# Altium project CartOgraphie.PrjPcb
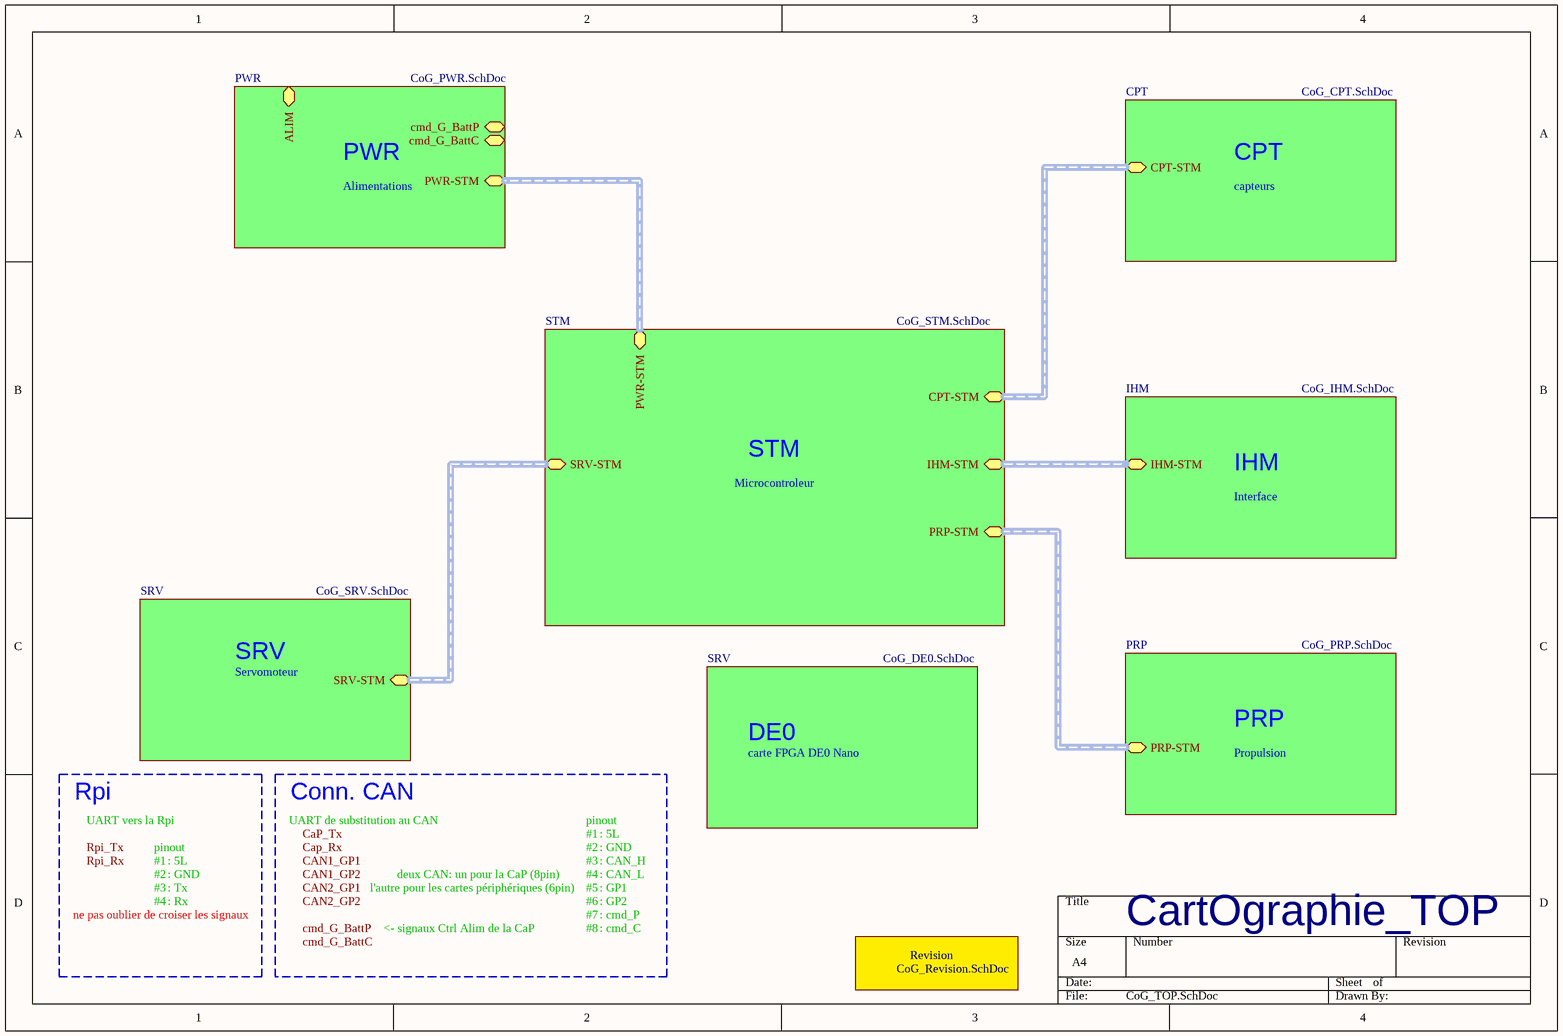
[diagram p0: CoG_TOP.SchDoc]
7 sheets, 65 parts. Net scope: hierarchical (ports join the sheet entries above them; power ports are global).
Board file: CartOgraphie.PcbDoc
Sheets:
  CoG_TOP.SchDoc
    Revision = CoG_Revision.SchDoc
    CPT = CoG_CPT.SchDoc
    PWR = CoG_PWR.SchDoc
    SRV = CoG_SRV.SchDoc
    STM = CoG_STM.SchDoc
    SRV = CoG_DE0.SchDoc

## Sheet CoG_TOP.SchDoc
size A4; Author: Audran; CompanyName: Goldorak; Address1: Electrolab; Address2: 52 rue Paul Lescop; Address3: 92000 Nanterre; ProjectName: Cartes_2017

### Sub-sheets
CPT = CoG_CPT.SchDoc: CPT-STM (harness CPT-STM)
IHM = CoG_IHM.SchDoc (file not in this document): IHM-STM (harness IHM-STM)
PRP = CoG_PRP.SchDoc (file not in this document): PRP-STM (harness PRP-STM)
PWR = CoG_PWR.SchDoc: PWR-STM (harness PWR-STM), cmd_G_BattP, cmd_G_BattC, ALIM (harness ALIM)
Revision = CoG_Revision.SchDoc: no entries
SRV = CoG_SRV.SchDoc: SRV-STM (harness SRV-STM)
SRV = CoG_DE0.SchDoc: no entries
STM = CoG_STM.SchDoc: CPT-STM (harness CPT-STM), SRV-STM (harness SRV-STM), PWR-STM (harness PWR-STM), PRP-STM (harness PRP-STM), IHM-STM (harness IHM-STM)

### Buses and harness runs
harness sheet CPT/CPT-STM = sheet STM/CPT-STM
harness sheet IHM/IHM-STM = sheet STM/IHM-STM
harness sheet PRP/PRP-STM = sheet STM/PRP-STM
harness sheet PWR/PWR-STM = sheet STM/PWR-STM
harness sheet SRV/SRV-STM = sheet STM/SRV-STM

### Notes on the sheet
- PWR
- CPT
- Alimentations
- capteurs
- Microcontroleur
- STM
- IHM
- Interface
- SRV
- Servomoteur
- DE0
- carte FPGA DE0 Nano
- PRP
- Propulsion
- Rpi
- UART vers la Rpi
- pinout
- UART de substitution au CAN
- Conn. CAN
- #1
- #2
- : 5L
- : GND
- ne pas oublier de croiser les signaux
- #3
- #4
- : Tx
- : Rx
- l'autre pour les cartes périphériques (6pin)
- deux CAN: un pour la CaP (8pin)
- #5
- #6
- #7
- : CAN_H
- : CAN_L
- : GP1
- : GP2
- : cmd_P
- <- signaux Ctrl Alim de la CaP
- #8
- : cmd_C
- CartOgraphie_TOP
- Labels drawn without touching a wire or pin: CAN1_GP1, CAN1_GP2, CAN2_GP1, CAN2_GP2, Cap_Rx, CaP_Tx, cmd_G_BattC, cmd_G_BattP, Rpi_Rx, Rpi_Tx

## Sheet CoG_Revision.SchDoc
size A4; Author: Audran; CompanyName: Goldorak; Address1: Electrolab; Address2: 52 rue Paul Lescop; Address3: 92000 Nanterre; ProjectName: Cartes_2017
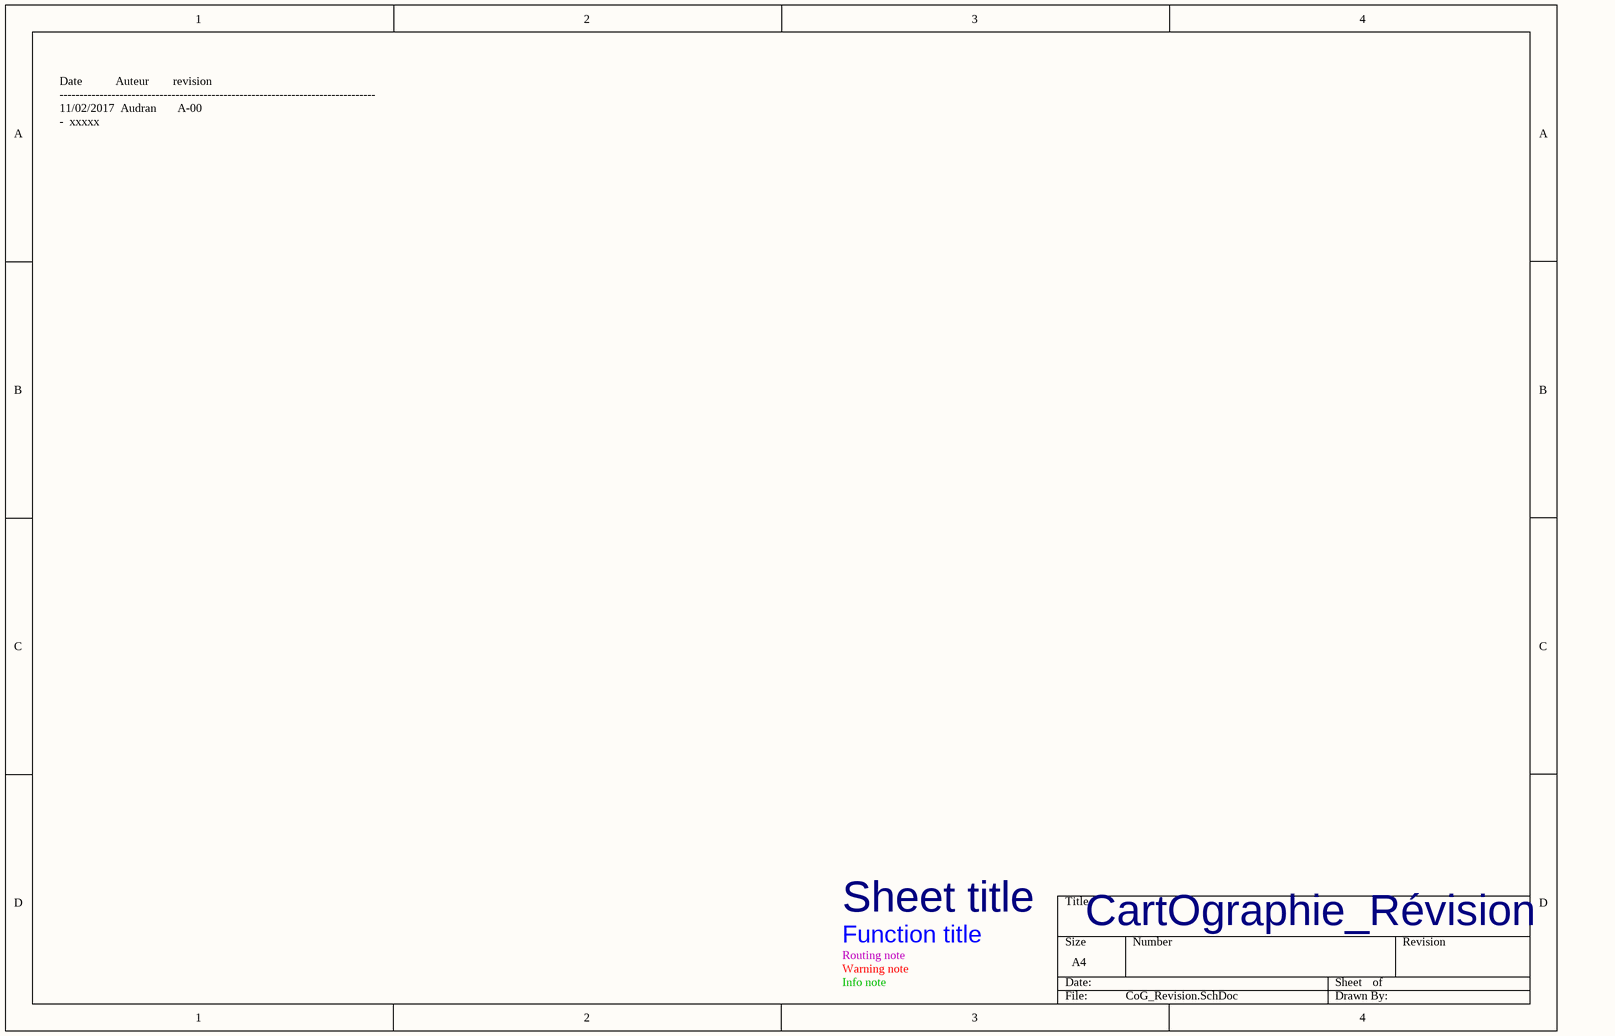
[diagram p1: CoG_Revision.SchDoc]

### Notes on the sheet
- Date           Auteur        revision
  -------------------------------------------------------------------------------
  11/02/2017  Audran       A-00
  -  xxxxx
- Sheet title
- Routing note
- Warning note
- Info note
- Function title
- CartOgraphie_Révision

## Sheet CoG_CPT.SchDoc
size A3; Author: Audran; CompanyName: Goldorak; Address1: Electrolab; Address2: 52 rue Paul Lescop; Address3: 92000 Nanterre; ProjectName: Cartes_2017
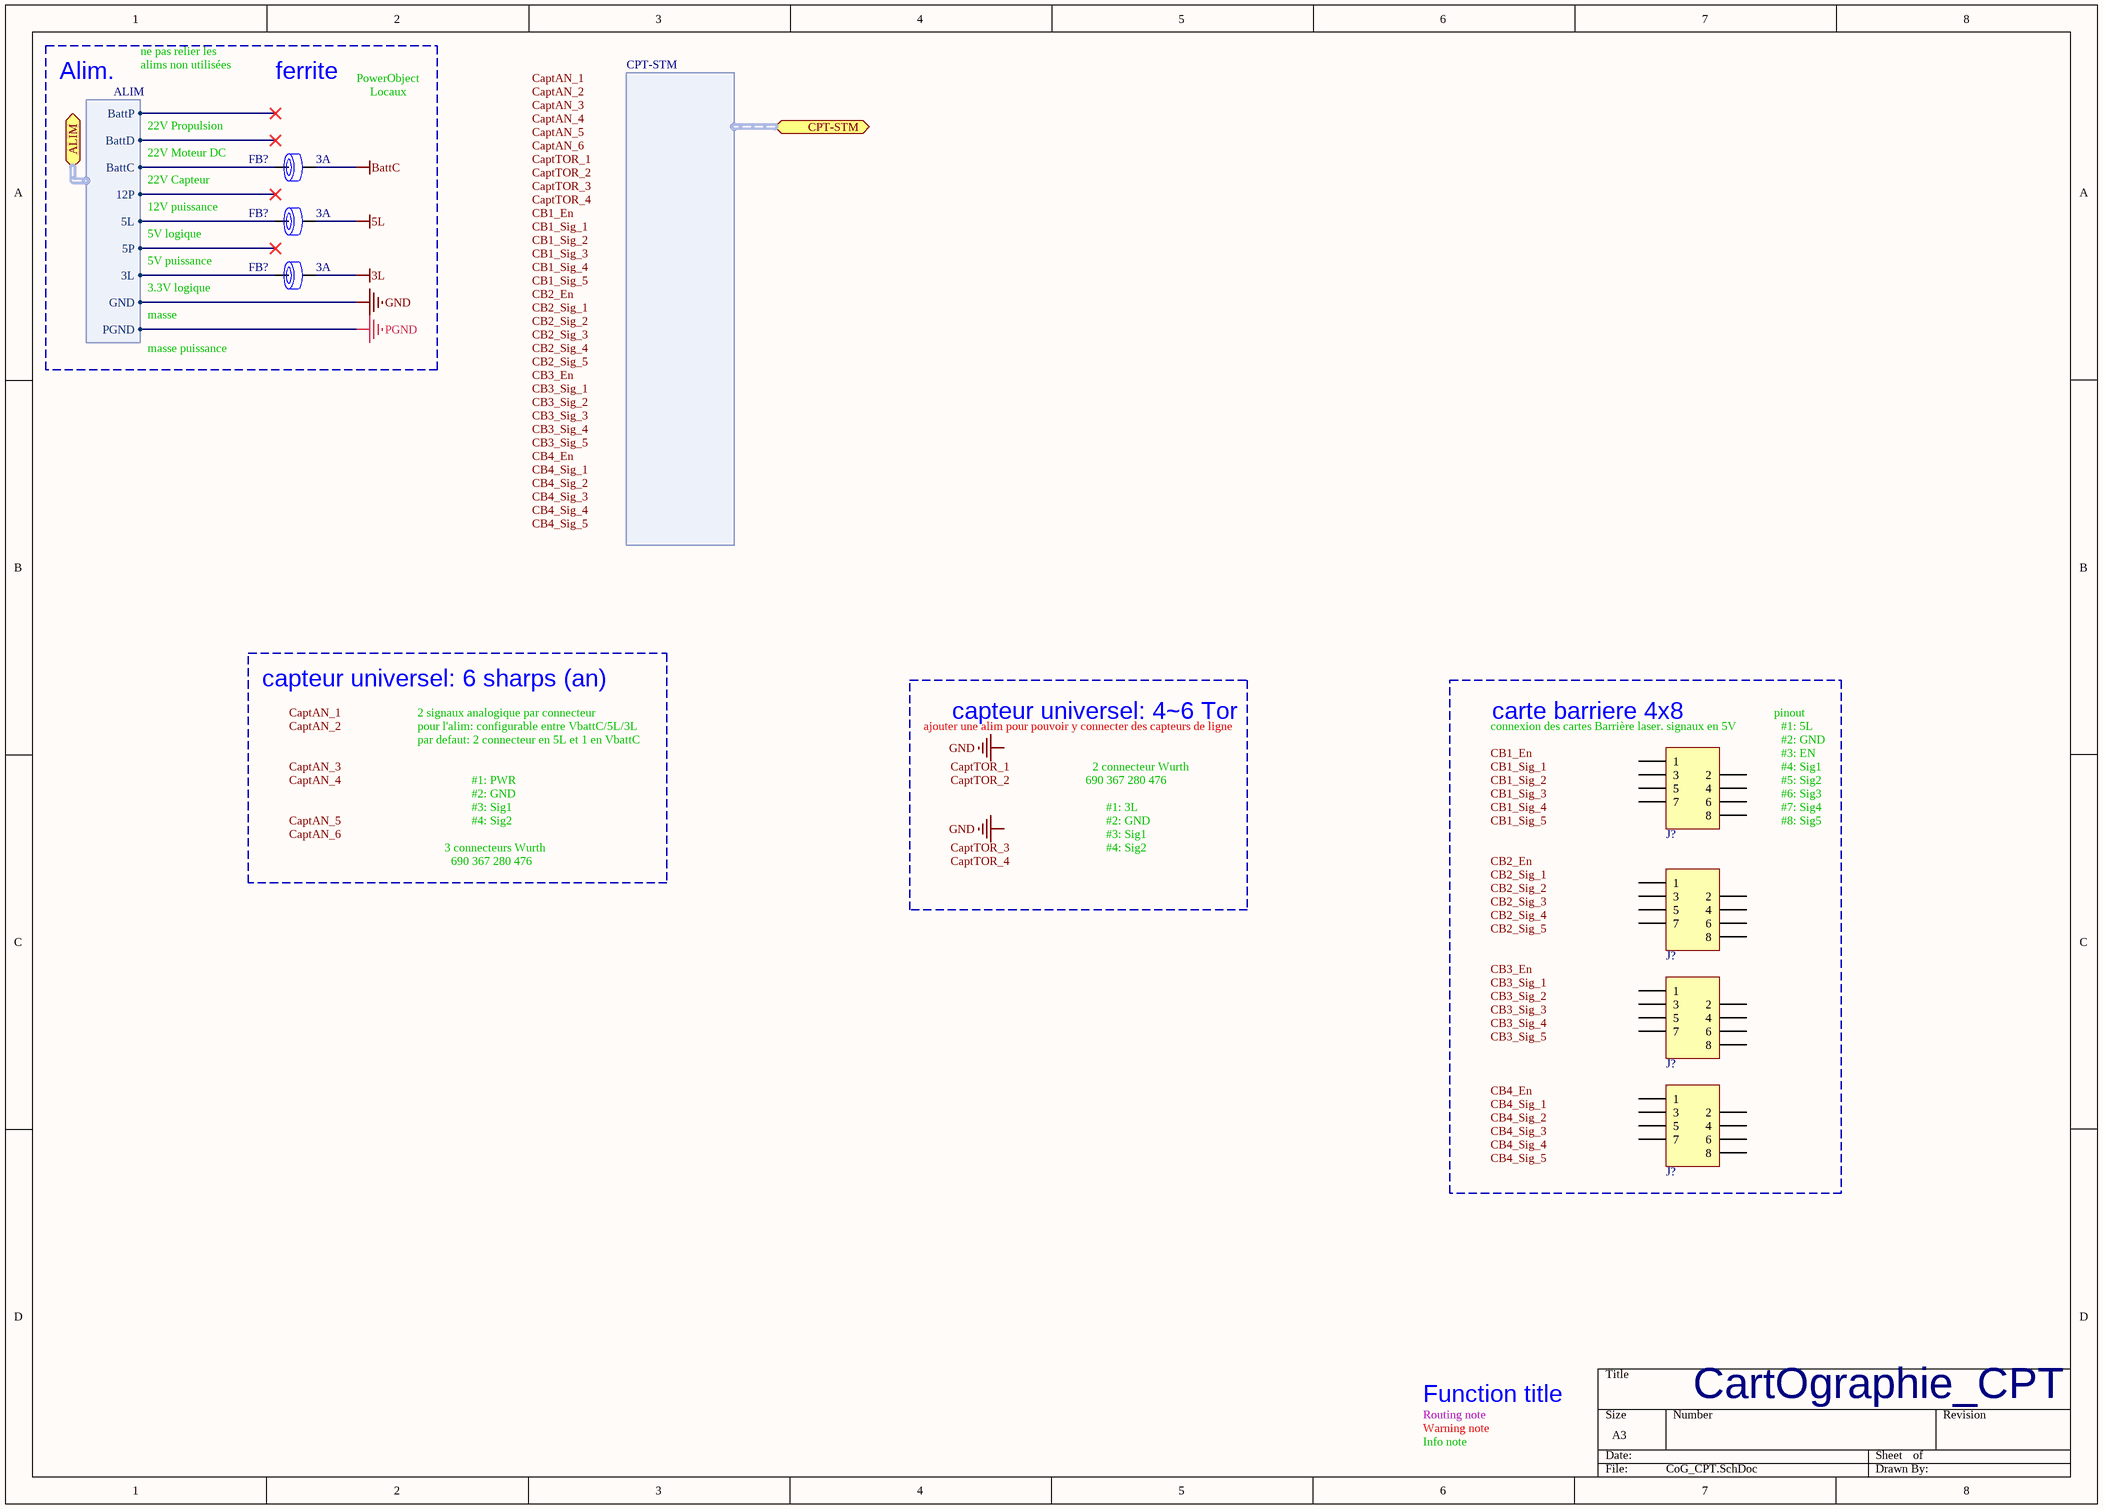
[diagram p2: CoG_CPT.SchDoc]

### Parts
(Parts that share a designator on the sheet are numbered #1, #2 ... from top to bottom, then left to right.)
FB?#1  RatedCurrent: 3A  [WE-CBF_0805_High Current]  (hidden comment: 742792023)
FB?#2  RatedCurrent: 3A  [WE-CBF_0805_High Current]  (hidden comment: 742792023)
FB?#3  RatedCurrent: 3A  [WE-CBF_0805_High Current]  (hidden comment: 742792023)
J?#1  (no value)  [690367280876]
J?#2  (no value)  [690367280876]
J?#3  (no value)  [690367280876]
J?#4  (no value)  [690367280876]

### Blocks framed on the sheet
carte barriere 4x8: J?#1-J?#4

### Ports
ALIM (harness ALIM), CPT-STM (harness CPT-STM)

### Harnesses
CPT-STM: 
ALIM: BattP, BattD, BattC, 12P, 5L, 5P, 3L, GND, PGND

### Nets
3L: FB?#3.2
5L: FB?#2.2
BattC: FB?#1.2
NetFB?#1_1: FB?#1.1 ; port ALIM.BattC
NetFB?#2_1: FB?#2.1 ; port ALIM.5L
NetFB?#3_1: FB?#3.1 ; port ALIM.3L

Not connected (* = marked no-connect by the designer): J?#1 1 2 3 4 5 6 7 8; J?#2 1 2 3 4 5 6 7 8; J?#3 1 2 3 4 5 6 7 8; J?#4 1 2 3 4 5 6 7 8

### Notes on the sheet
- Alim.
- ne pas relier les
- alims non utilisées
- ferrite
- PowerObject
- Locaux
- 22V Propulsion
- 22V Moteur DC
- 22V Capteur
- 5V logique
- 12V puissance
- 5V puissance
- 3.3V logique
- masse
- masse puissance
- capteur universel: 6 sharps (an)
- 2 signaux analogique par connecteur
- capteur universel: 4~6 Tor
- pinout
- pour l'alim: configurable entre VbattC/5L/3L
- par defaut: 2 connecteur en 5L et 1 en VbattC
- #1: PWR
- ajouter une alim pour pouvoir y connecter des capteurs de ligne
- 690 367 280 476
- 2 connecteur Wurth
- (near J?#1) connexion des cartes Barrière laser. signaux en 5V
- #1: 5L
- #2: GND
- #3: EN
- #4: Sig1
- #5: Sig2
- 3 connecteurs Wurth
- #3: Sig1
- #4: Sig2
- #1: 3L
- #6: Sig3
- #7: Sig4
- #8: Sig5
- Routing note
- Warning note
- Info note
- Function title
- CartOgraphie_CPT
- Labels drawn without touching a wire or pin: CaptAN_1, CaptAN_2, CaptAN_3, CaptAN_4, CaptAN_5, CaptAN_6, CaptTOR_1, CaptTOR_2, CaptTOR_3, CaptTOR_4, CB1_En, CB1_Sig_1, CB1_Sig_2, CB1_Sig_3, CB1_Sig_4, CB1_Sig_5, CB2_En, CB2_Sig_1, CB2_Sig_2, CB2_Sig_3, CB2_Sig_4, CB2_Sig_5, CB3_En, CB3_Sig_1, CB3_Sig_2, CB3_Sig_3, CB3_Sig_4, CB3_Sig_5, CB4_En, CB4_Sig_1, CB4_Sig_2, CB4_Sig_3, CB4_Sig_4, CB4_Sig_5, GND

### Library data of the parts
FB?#1-FB?#3 = WE-CBF, 742792023: Ferrite Bead 120ohm 0805 max3.0A; Manufacturer: Wurth Elektronik; Value: 120Ω; Type: High Current; PublishedDate: Aug 2016; ComponentLink1Description: Manufacturer; ComponentLink1URL: http://www.we-online.de; ComponentLink2Description: Datasheet; ComponentLink2URL: http://katalog.we-online.de/pbs/datasheet/742792023.pdf; Manufacturer Part Number: 742792023; Size: 0805
J?#1-J?#4 = 690367280876: WR-MM Female SMT Connector with Polarization; Manufacturer 1: W¨¹rth Elektronik eiSos GmbH; ComponentLink1 Description: Manufacturer; ComponentLink2 Description: Datasheet; Value: 8; Manufacturer Part Number: 690367280876; ComponentLink1URL: http://www.we-online.com; ComponentLink2URL: http://katalog.we-online.de/em/datasheet/69036728xx76.pdf; Supplier 1: Farnell; Supplier Part Number 1: 1641850

## Sheet CoG_PWR.SchDoc
size A3; Author: Audran; CompanyName: Goldorak; Address1: Electrolab; Address2: 52 rue Paul Lescop; Address3: 92000 Nanterre; ProjectName: Cartes_2017
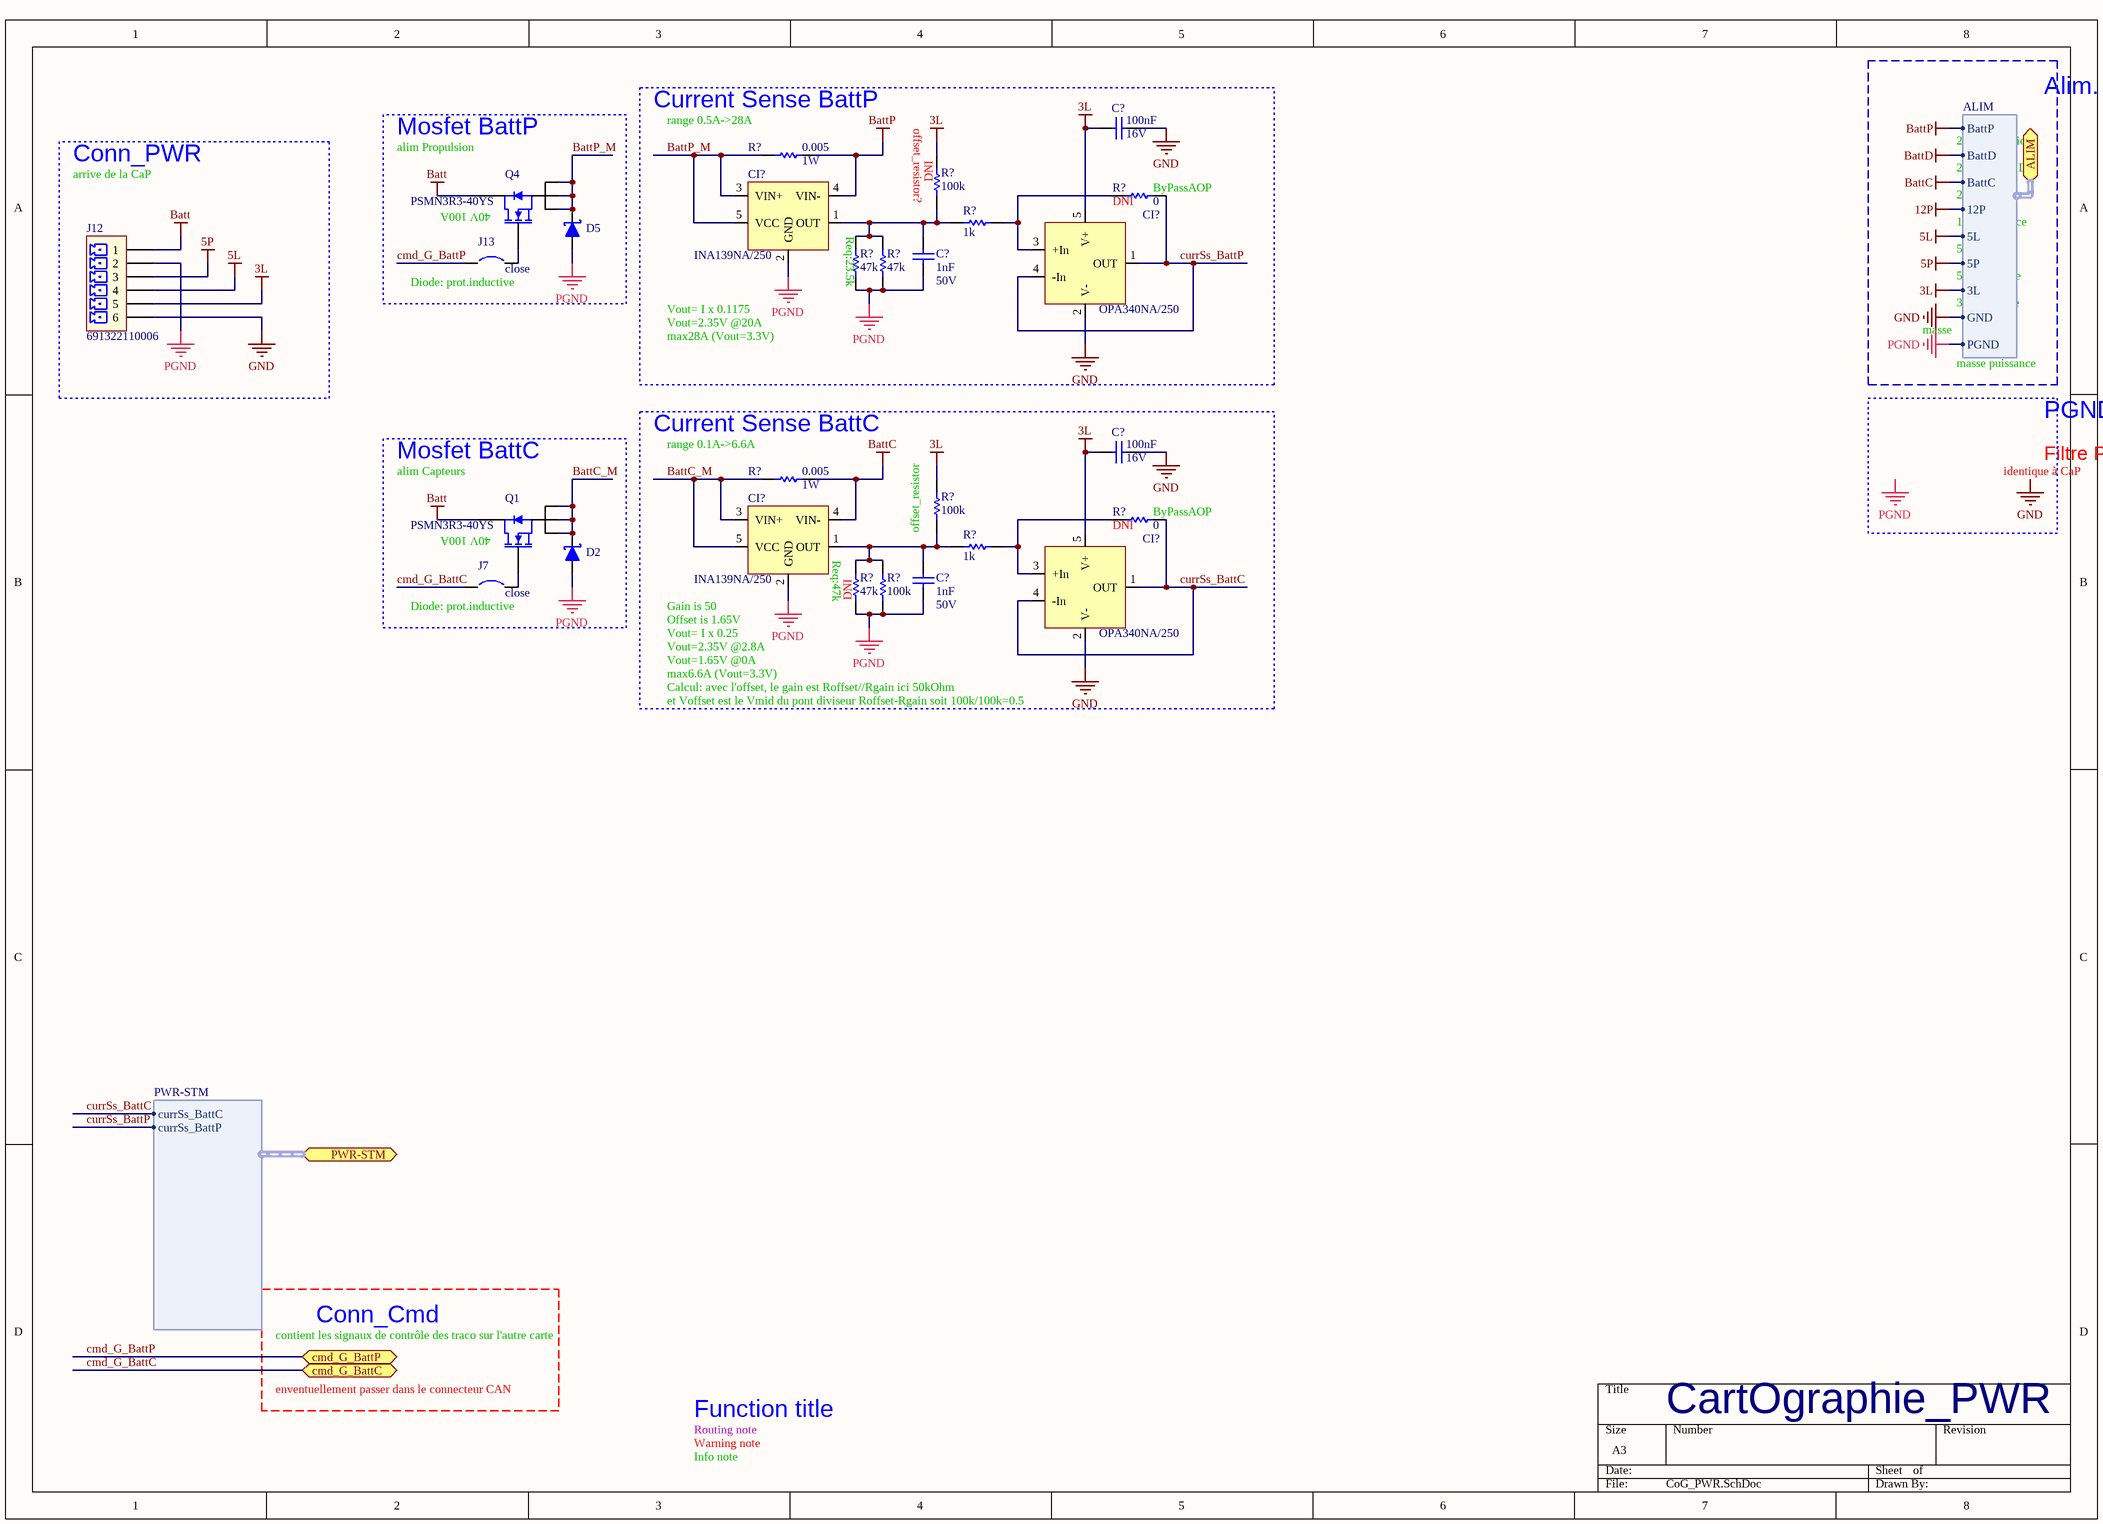
[diagram p3: CoG_PWR.SchDoc]

### Parts
(Parts that share a designator on the sheet are numbered #1, #2 ... from top to bottom, then left to right.)
C?#1  100nF  RatedVoltage: 16V  [WCAP-CSGP_0402, 1x0.5x0.5]
C?#2  1nF  RatedVoltage: 50V  [WCAP-CSGP_0402, 1x0.5x0.5]
C?#3  100nF  RatedVoltage: 16V  [WCAP-CSGP_0402, 1x0.5x0.5]
C?#4  1nF  RatedVoltage: 50V  [WCAP-CSGP_0402, 1x0.5x0.5]
CI?#1  INA139NA/250  [SOT95P245X145-5N]
CI?#2  OPA340NA/250  [SOT95P245X145-5N]
CI?#3  INA139NA/250  [SOT95P245X145-5N]
CI?#4  OPA340NA/250  [SOT95P245X145-5N]
D2  RBR3MM40ATFTR  [SOD-123FL]  (value not drawn)
D5  RBR3MM40ATFTR  [SOD-123FL]  (value not drawn)
J7  close  [SB_0603]  (no BOM)
J12  691322110006  [691322110006]
J13  close  [SB_0603]  (no BOM)
Q1  PSMN3R3-40YS  [LFPAK (SOT669)]
Q4  PSMN3R3-40YS  [LFPAK (SOT669)]
R?#1  value 0.005  Power: 1W  [WSLP1206]  (hidden comment: WSLP12065L000FEA)
R?#2  value 0  [RESC1005X04N]  (hidden comment: RC0402JR-070RL)
R?#3  value 100k  [RESC1005X04N]  (hidden comment: RC0402FR-07100KL)
R?#4  value 1k  [RESC1005X04N]  (hidden comment: RC0402FR-071KL)
R?#5  value 47k  [RESC1005X04N]
R?#6  value 47k  [RESC1005X04N]
R?#7  value 0.005  Power: 1W  [WSLP1206]  (hidden comment: WSLP12065L000FEA)
R?#8  value 0  [RESC1005X04N]  (hidden comment: RC0402JR-070RL)
R?#9  value 100k  [RESC1005X04N]  (hidden comment: RC0402FR-07100KL)
R?#10  value 1k  [RESC1005X04N]  (hidden comment: RC0402FR-071KL)
R?#11  value 47k  [RESC1005X04N]
R?#12  value 100k  [RESC1005X04N]  (hidden comment: RC0402FR-07100KL)

### Blocks framed on the sheet
Conn_PWR: J12
Mosfet BattP: D5 J13 Q4
Current Sense BattP: C?#1 C?#2 CI?#1 CI?#2 R?#1-R?#6
Mosfet BattC: D2 J7 Q1
Current Sense BattC: C?#3 C?#4 CI?#3 CI?#4 R?#7-R?#12

### Ports
ALIM (harness ALIM), cmd_G_BattC, cmd_G_BattP, PWR-STM (harness PWR-STM)

### Harnesses
PWR-STM: currSs_BattC, currSs_BattP
ALIM: BattP, BattD, BattC, 12P, 5L, 5P, 3L, GND, PGND

### Nets
3L: C?#1.1 C?#3.1 CI?#2.5(V+) CI?#4.5(V+) J12.5 R?#3.2 R?#9.2 ; port ALIM.3L
5L: J12.4 ; port ALIM.5L
5P: J12.3 ; port ALIM.5P
Batt: J12.1 Q1.5(D) Q4.5(D)
BattC: CI?#3.4(VIN-) R?#7.2 ; port ALIM.BattC
BattD: port ALIM.BattD
BattP: CI?#1.4(VIN-) R?#1.2 ; port ALIM.BattP
GND: C?#1.2 C?#3.2 CI?#2.2(V-) CI?#4.2(V-) J12.6 ; port ALIM.GND
PGND: C?#2.1 C?#4.1 CI?#1.2(GND) CI?#3.2(GND) D2.1 D5.1 J12.2 R?#5.1 R?#6.1 R?#11.1 R?#12.1 ; port ALIM.PGND
BattC_M: CI?#3.3(VIN+) CI?#3.5(VCC) D2.2 Q1.1(S) Q1.2(S) Q1.3(S) R?#7.1
BattP_M: CI?#1.3(VIN+) CI?#1.5(VCC) D5.2 Q4.1(S) Q4.2(S) Q4.3(S) R?#1.1
cmd_G_BattC: J7.1 ; port cmd_G_BattC
cmd_G_BattP: J13.1 ; port cmd_G_BattP
currSs_BattC: CI?#4.1(OUT) CI?#4.4(-In) R?#8.2 ; port PWR-STM.currSs_BattC
currSs_BattP: CI?#2.1(OUT) CI?#2.4(-In) R?#2.2 ; port PWR-STM.currSs_BattP
NetC?#2_2: C?#2.2 CI?#1.1(OUT) R?#3.1 R?#4.1 R?#5.2 R?#6.2
NetC?#4_2: C?#4.2 CI?#3.1(OUT) R?#9.1 R?#10.1 R?#11.2 R?#12.2
NetCI?#2_3: CI?#2.3(+In) R?#2.1 R?#4.2
NetCI?#4_3: CI?#4.3(+In) R?#8.1 R?#10.2
NetJ7_2: J7.2 Q1.4(G)
NetJ13_2: J13.2 Q4.4(G)

### Notes on the sheet
- (near R?#1) range 0.5A->28A
- offset_resistor?
- Alim.
- arrive de la CaP
- (near Q4) alim Propulsion
- (near R?#3) DNI
- (near R?#2) ByPassAOP
- 22V Propulsion
- 22V Moteur DC
- 22V Capteur
- (near Q4) 40V 100A
- (near R?#5) Req:23.5k
- (near R?#2) DNI
- 5V logique
- 12V puissance
- (near J13) Diode: prot.inductive
- Vout= I x 0.1175
- Vout=2.35V @20A
- masse
- 5V puissance
- 3.3V logique
- max28A (Vout=3.3V)
- masse puissance
- (near R?#7) range 0.1A->6.6A
- Filtre PGND->GND
- PGND->GND
- (near Q1) alim Capteurs
- (near Q1) 40V 100A
- (near R?#9) offset_resistor
- (near R?#8) DNI
- (near R?#8) ByPassAOP
- identique à CaP
- (near CI?#3) Req:47k
- (near R?#11) DNI
- (near J7) Diode: prot.inductive
- Vout= I x 0.25
- Vout=2.35V @2.8A
- (near CI?#3) Gain is 50
- (near CI?#3) Offset is 1.65V
- Vout=1.65V @0A
- max6.6A (Vout=3.3V)
- Calcul: avec l'offset, le gain est Roffset//Rgain ici 50kOhm
- et Voffset est le Vmid du pont diviseur Roffset-Rgain soit 100k/100k=0.5
- contient les signaux de contrôle des traco sur l'autre carte
- Conn_Cmd
- enventuellement passer dans le connecteur CAN
- Routing note
- Warning note
- Info note
- Function title
- CartOgraphie_PWR
- Labels drawn without touching a wire or pin: GND, PGND

### Library data of the parts
C?#1 C?#3 = WCAP-CSGP, 885012205037: CAP CER 100nF 16V X7R 0402; Manufacturer: Wurth Elektronik; PublishedDate: Aug 2016; ComponentLink1Description: Manufacturer; ComponentLink1URL: http://www.we-online.de; ComponentLink2Description: Datasheet; ComponentLink2URL: http://katalog.we-online.com/pbs/datasheet/885012205037.pdf; Value: 100nF; Size: 0402; CeramicType: X7R; Manufacturer Part Number: 885012205037
C?#2 C?#4 = WCAP-CSGP, 885012205061: CAP CER 1nF 50V X7R 0402; Manufacturer: Wurth Elektronik; PublishedDate: Aug 2016; ComponentLink1Description: Manufacturer; ComponentLink1URL: http://www.we-online.de; ComponentLink2Description: Datasheet; ComponentLink2URL: http://katalog.we-online.com/pbs/datasheet/885012205061.pdf; Manufacturer Part Number: 885012205061; Value: 1nF; Size: 0402; CeramicType: X7R
CI?#1 CI?#3 = INA139NA/250: IC CURRENT MONITOR 0.5% SOT23-5; Manufacturer: Texas Instruments; Supplier 1: Farnell; Supplier Part Number 1: 1470398; Manufacturer Part Number: INA139NA/250; ComponentLink1URL: http://www.ti.com/lit/ds/symlink/ina139.pdf; ComponentLink1Description: http://www.ti.com/lit/ds/symlink/ina139.pdf
CI?#2 CI?#4 = OPA340NA/250: IC OP AMP GP 5.5MHZ RRIO SOT23-5; Manufacturer: Texas Instruments; Supplier 1: Farnell; Supplier Part Number 1: 1470372; ComponentLink1URL: http://www.ti.com/lit/ds/symlink/opa2340.pdf; ComponentLink1Description: http://www.ti.com/lit/ds/symlink/opa2340.pdf; Manufacturer Part Number: OPA340NA/250
D2 D5 = RBR3MM40ATFTR: DIODE SCHOTTKY 40V 3A SOD123-FL; Manufacturer: ROHM; Type: Schottky; ReverseVoltage: 40V; ContinuousForwardCurrent: 3A; ComponentLink1Description: Manufacturer; ComponentLink1URL: http://www.rohm.com/web/global/products/-/product/RBR3MM40ATF; ComponentLink2URL: http://www.farnell.com/datasheets/2067190.pdf; ComponentLink2Description: Datasheet; Supplier 1: Farnell; Supplier Part Number 1: 2581593; Manufacturer Part Number: RBR3MM40ATFTR
J7 J13 = CAVALIER_0603: Circuit Breaker (cavalier soudure) empreinte dipole 0603
J12 = 691322110006: TERM BLOCK HDR 6POS 90DEG 3.5MM; Manufacturer: Wurth Electronics Inc.; Supplier 1: Farnell; Manufacturer Part Number: 691322110006; ComponentLink1URL: http://katalog.we-online.de/em/datasheet/6913221100xx.pdf; ComponentLink1Description: Datasheet; Supplier Part Number 1: 1841319
Q1 Q4 = PSMN3R3-40YS: MOSFET N  40V 100A LFPAK; Manufacturer: NEXPERIA; Manufacturer Part Number: PSMN3R3-40YS; ComponentLink1URL: http://www.farnell.com/datasheets/1230735.pdf; ComponentLink1Description: Datasheet; Pricing: 1=0.498, 25=0.488, 100=0.486, 250=0.476, 500=0.467, 3000=0.457, 7000=0.447, 20000=0.437 (EUR); Supplier 1: Farnell; Supplier Part Number 1: 1845655
R?#1 R?#7 = WSLP12065L000FEA: RES 0.005 OHM 1% 1W 1206; Manufacturer: Vishay Dale; Vmax: 200V; Type: Metal Strip; Manufacturer Part Number: WSLP12065L000FEA; Precision: ±1%; Supplier 1: Farnell; ComponentLink1URL: https://www.vishay.com/product?docid=30122; ComponentLink1Description: Manufacturer; ComponentLink2URL: http://www.farnell.com/datasheets/2182713.pdf; ComponentLink2Description: Datasheet; Supplier Part Number 1: 2420761
R?#2 R?#8 = RC0402JR-070RL: RES SMD 0 OHM 5% 1/16W 0402; Manufacturer: Yageo; Power: 63mW; Vmax: 50V; Type: Thick Film; ComponentLink1Description: Manufacturer; ComponentLink1URL: http://www.yageo.com/NewPortal/_en/index.jsp; ComponentLink2Description: Datasheet; ComponentLink2URL: http://www.farnell.com/datasheets/1018594.pdf; Manufacturer Part Number: RC0402JR-070RL; Supplier 1: Farnell; Supplier Part Number 1: 9232516; Precision: ±5%
R?#3 R?#9 R?#12 = RC0402FR-07100KL: RES SMD 100K OHM 1% 1/16W 0402; Manufacturer: Yageo; Power: 63mW; Vmax: 50V; Type: Thick Film; ComponentLink1Description: Manufacturer; ComponentLink1URL: http://www.yageo.com/NewPortal/_en/index.jsp; ComponentLink2Description: Datasheet; ComponentLink2URL: http://www.farnell.com/datasheets/2167052.pdf; Manufacturer Part Number: RC0402FR-07100KL; Supplier 1: Farnell; Supplier Part Number 1: 9239472; Precision: ±1%
R?#4 R?#10 = RC0402FR-071KL: RES SMD 1K OHM 1% 1/16W 0402; Manufacturer: Yageo; Power: 63mW; Vmax: 50V; Type: Thick Film; ComponentLink1Description: Manufacturer; ComponentLink1URL: http://www.yageo.com/NewPortal/_en/index.jsp; ComponentLink2Description: Datasheet; ComponentLink2URL: http://www.farnell.com/datasheets/2167052.pdf; Manufacturer Part Number: RC0402FR-071KL; Supplier 1: Farnell; Supplier Part Number 1: 9239235; Precision: ±1%
R?#5 R?#6 R?#11 = RC0402FR-0747KL: RES SMD 47K OHM 1% 1/16W 0402; Manufacturer: Yageo; Power: 63mW; Vmax: 50V; Type: Thick Film; ComponentLink1Description: Manufacturer; ComponentLink1URL: http://www.yageo.com/NewPortal/_en/index.jsp; ComponentLink2Description: Datasheet; ComponentLink2URL: http://www.farnell.com/datasheets/2167052.pdf; Manufacturer Part Number: RC0402FR-0747KL; Supplier 1: Farnell; Supplier Part Number 1: 9239430; Precision: ±1%

## Sheet CoG_SRV.SchDoc
size A4; Author: Audran; CompanyName: Goldorak; Address1: Electrolab; Address2: 52 rue Paul Lescop; Address3: 92000 Nanterre; ProjectName: Cartes_2017
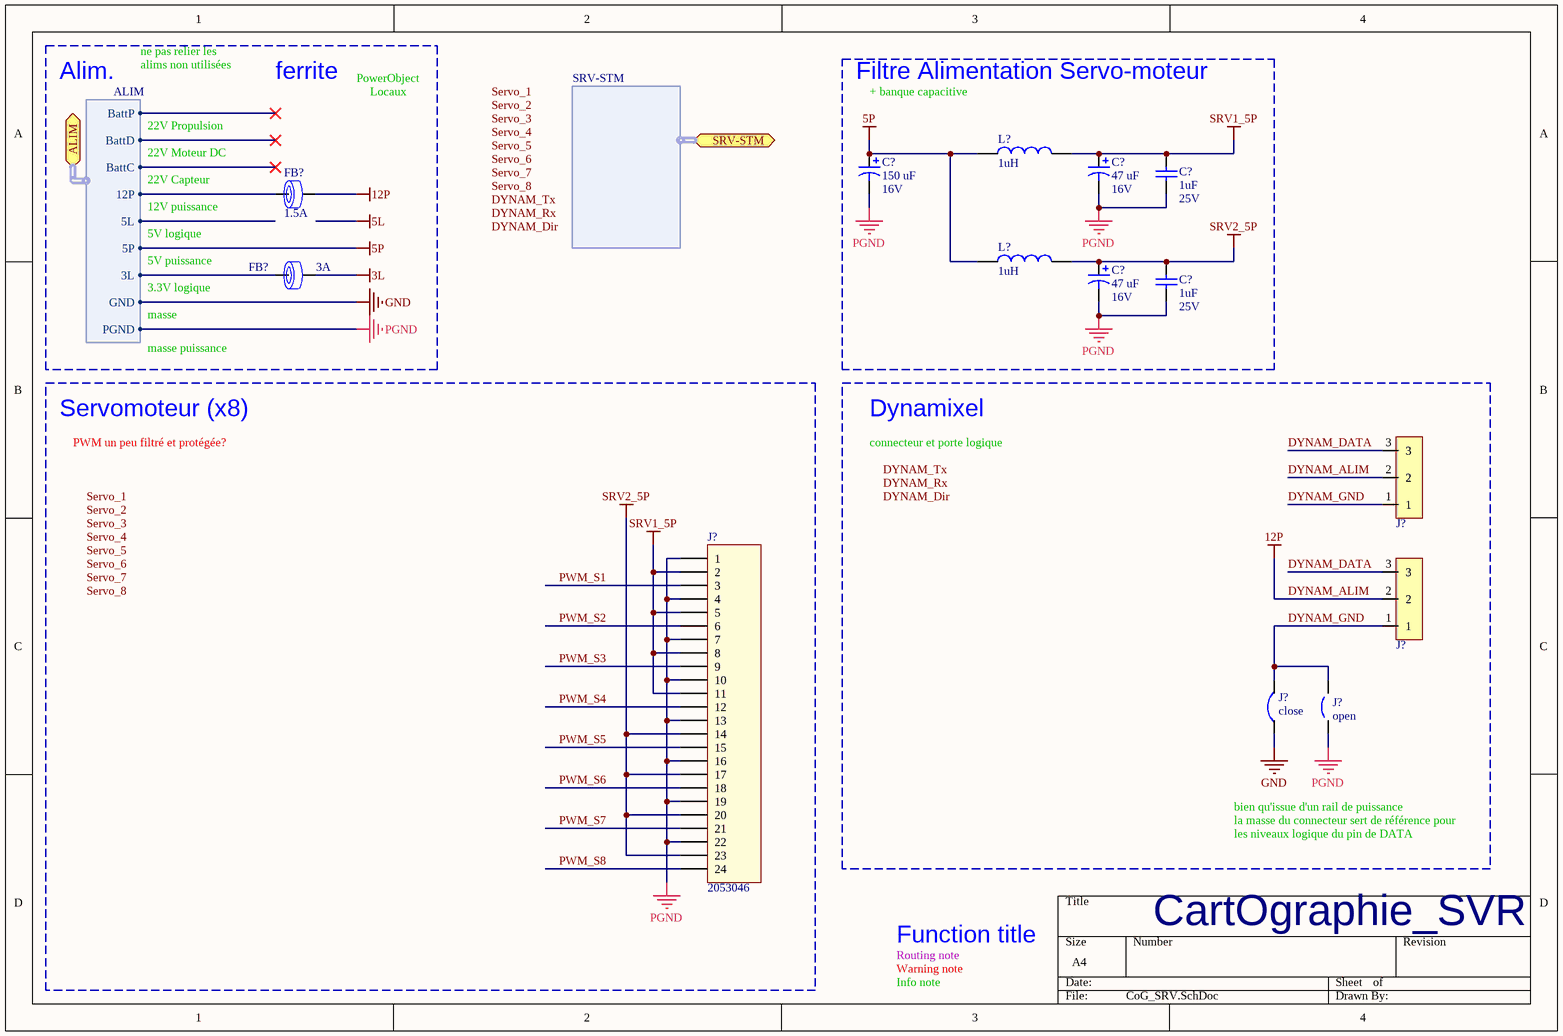
[diagram p4: CoG_SRV.SchDoc]

### Parts
(Parts that share a designator on the sheet are numbered #1, #2 ... from top to bottom, then left to right.)
C?#5  150 uF  RatedVoltage: 16V  [WCAP-ATG8_6.3x11x2.5x0.5]
C?#6  47 uF  RatedVoltage: 16V  [WCAP-ATG8_5x11x2x0.5]
C?#7  1uF  RatedVoltage: 25V  [WCAP-CSGP_0603, 1.6x0.8x0.8]
C?#8  47 uF  RatedVoltage: 16V  [WCAP-ATG8_5x11x2x0.5]
C?#9  1uF  RatedVoltage: 25V  [WCAP-CSGP_0603, 1.6x0.8x0.8]
FB?#4  RatedCurrent: 1.5A  [WE-CBF_0603_High Current]  (hidden comment: 742792624)
FB?#5  RatedCurrent: 3A  [WE-CBF_0805_High Current]  (hidden comment: 742792023)
J?#5  22-03-5035  [20-03-5035]  (value not drawn)
J?#6  22-03-5035  [20-03-5035]  (value not drawn)
J?#7  Supplier Part Number 1: 2053046  [TSW-108-08-F-T-RA]  (hidden comment: TSW-108-08-F-T-RA)
J?#8  close  [CAVALIER_0603_C]  (no BOM)
J?#9  open  [CAVALIER_0603_O]  (no BOM)
L?#1  value 1uH  [WE-PD2_4532]  (hidden comment: WE-PD2, 7447730)
L?#2  value 1uH  [WE-PD2_4532]  (hidden comment: WE-PD2, 7447730)

### Blocks framed on the sheet
Filtre Alimentation Servo-moteur: C?#5-C?#9 L?#1 L?#2
Servomoteur (x8): J?#7
Dynamixel: J?#5 J?#6 J?#8 J?#9

### Ports
ALIM (harness ALIM), SRV-STM (harness SRV-STM)

### Harnesses
SRV-STM: 
ALIM: BattP, BattD, BattC, 12P, 5L, 5P, 3L, GND, PGND

### Nets
3L: FB?#5.2
5P: C?#5.1 L?#1.1 L?#2.1 ; port ALIM.5P
DYNAM_ALIM: FB?#4.2 J?#5.2 J?#6.2  [also labelled 12P]
GND: J?#8.1 ; port ALIM.GND
PGND: C?#5.2 C?#6.2 C?#7.1 C?#8.2 C?#9.1 J?#7.1 J?#7.4 J?#7.7 J?#7.10 J?#7.13 J?#7.16 J?#7.19 J?#7.22 J?#9.1 ; port ALIM.PGND
SRV1_5P: C?#6.1 C?#7.2 J?#7.2 J?#7.5 J?#7.8 J?#7.11 L?#1.2
SRV2_5P: C?#8.1 C?#9.2 J?#7.14 J?#7.17 J?#7.20 J?#7.23 L?#2.2
DYNAM_DATA: J?#5.3 J?#6.3
DYNAM_GND: J?#5.1 J?#6.1 J?#8.2 J?#9.2
PWM_S1: J?#7.3
PWM_S2: J?#7.6
PWM_S3: J?#7.9
PWM_S4: J?#7.12
PWM_S5: J?#7.15
PWM_S6: J?#7.18
PWM_S7: J?#7.21
PWM_S8: J?#7.24
NetFB?#4_1: FB?#4.1 ; port ALIM.12P
NetFB?#5_1: FB?#5.1 ; port ALIM.3L

### Notes on the sheet
- Alim.
- ne pas relier les
- alims non utilisées
- ferrite
- PowerObject
- Locaux
- + banque capacitive
- 22V Propulsion
- 22V Moteur DC
- 5V logique
- 12V puissance
- 22V Capteur
- 5V puissance
- 3.3V logique
- masse
- masse puissance
- PWM un peu filtré et protégée?
- connecteur et porte logique
- bien qu'issue d'un rail de puissance
- la masse du connecteur sert de référence pour
- les niveaux logique du pin de DATA
- Routing note
- Warning note
- Info note
- Function title
- CartOgraphie_SVR
- Labels drawn without touching a wire or pin: DYNAM_Dir, DYNAM_Rx, DYNAM_Tx, Servo_1, Servo_2, Servo_3, Servo_4, Servo_5, Servo_6, Servo_7, Servo_8

### Library data of the parts
C?#5 = WCAP-ATG8, 860010373008: CAP Alu 150 UF 20% 16 V; Manufacturer: Wurth Elektronik; PublishedDate: July 2016; ComponentLink1Description: Manufacturer; ComponentLink1URL: http://www.we-online.de; ComponentLink2Description: Datasheet; ComponentLink2URL: http://katalog.we-online.de/pbs/datasheet/860010373008.pdf; Manufacturer Part Number: 860010373008; Value: 150 uF; Size: 6.3mmx11mm
C?#6 C?#8 = WCAP-ATG8, 860010372004: CAP Alu 47 UF 20% 16 V; Manufacturer: Wurth Elektronik; PublishedDate: July 2016; ComponentLink1Description: Manufacturer; ComponentLink1URL: http://www.we-online.de; ComponentLink2Description: Datasheet; ComponentLink2URL: http://katalog.we-online.de/pbs/datasheet/860010372004.pdf; Manufacturer Part Number: 860010372004; Value: 47 uF; Size: 5mmx11mm
C?#7 C?#9 = WCAP-CSGP, 885012206076: CAP CER 1uF 25V X7R 0603; Manufacturer: Wurth Elektronik; PublishedDate: Aug 2016; ComponentLink1Description: Manufacturer; ComponentLink1URL: http://www.we-online.de; ComponentLink2Description: Datasheet; ComponentLink2URL: http://katalog.we-online.com/pbs/datasheet/885012206076.pdf; Manufacturer Part Number: 885012206076; Value: 1uF; Size: 0603; CeramicType: X7R
FB?#4 = WE-CBF, 742792624: Ferrite Bead 180ohm 0603 max1.5A; Manufacturer: Wurth Elektronik; Value: 180Ω; Type: High Current; PublishedDate: Aug 2016; ComponentLink1Description: Manufacturer; ComponentLink1URL: http://www.we-online.de; ComponentLink2Description: Datasheet; ComponentLink2URL: http://katalog.we-online.de/pbs/datasheet/742792624.pdf; Manufacturer Part Number: 742792624; Size: 0603
FB?#5 = WE-CBF, 742792023: as FB?#1 on sheet CoG_CPT; PublishedDate: Aug 2016; ComponentLink1Description: Manufacturer; ComponentLink1URL: http://www.we-online.de; ComponentLink2Description: Datasheet; ComponentLink2URL: http://katalog.we-online.de/pbs/datasheet/742792023.pdf; Manufacturer Part Number: 742792023; Size: 0805
J?#5 J?#6 = 20-03-5035: Manufacturer 1: MOLEX; Supplier 1: Farnell; Supplier Part Number 1: 9979620; Manufacturer Part Number: 22-03-5035; Pricing: 10=0.153, 100=0.144, 250=0.118, 500=0.091, 1000=0.059, 2500=0.057, 2500=0.0441, 30000=0.0397 (EUR); ComponentLink1URL: http://www.farnell.com/cad/495071.pdf; ComponentLink1Description: http://www.farnell.com/cad/495071.pdf; ComponentLink2URL: http://www.farnell.com/datasheets/1801024.pdf; ComponentLink2Description: http://www.farnell.com/datasheets/1801024.pdf; ComponentLink3Description: http://fr.farnell.com/jsp/level5/module.jsp?moduleId=fr/418942.xml; ComponentLink3URL: http://fr.farnell.com/jsp/level5/module.jsp?moduleId=fr/418942.xml
J?#7 = TSW-108-08-F-T-RA: samtec 3x8 : TSW-108-08-F-T-RA; Manufacturer Part Number: TSW-104-08-F-T-RA; Manufacturer 1: SAMTEC; ComponentLink2URL: http://cloud.samtec.com/catalog_english/TSW_TH.PDF; ComponentLink2Description: http://cloud.samtec.com/catalog_english/TSW_TH.PDF; Supplier 1: Farnell
J?#8 = CAVALIER_0603_C: Cavalier soudure "fermé" + empreinte dipole 0603
J?#9 = CAVALIER_0603_O: Cavalier soudure "ouvert" + empreinte dipole 0603
L?#1 L?#2 = WE-PD2, 7447730: FIXED IND 1UH 4A 49 MOHM SMD; PublishedDate: Sep. 2016; Publisher: Wurth Elektronik; ComponentLink1Description: Manufacturer; ComponentLink1URL: http://www.we-online.de; ComponentLink2Description: Datasheet; ComponentLink2URL: http://katalog.we-online.de/pbs/datasheet/7447730.pdf; PartNumber: 7447730; Size: 4532

## Sheet CoG_STM.SchDoc
size A3; Author: Audran; CompanyName: Goldorak; Address1: Electrolab; Address2: 52 rue Paul Lescop; Address3: 92000 Nanterre; ProjectName: Cartes_2017
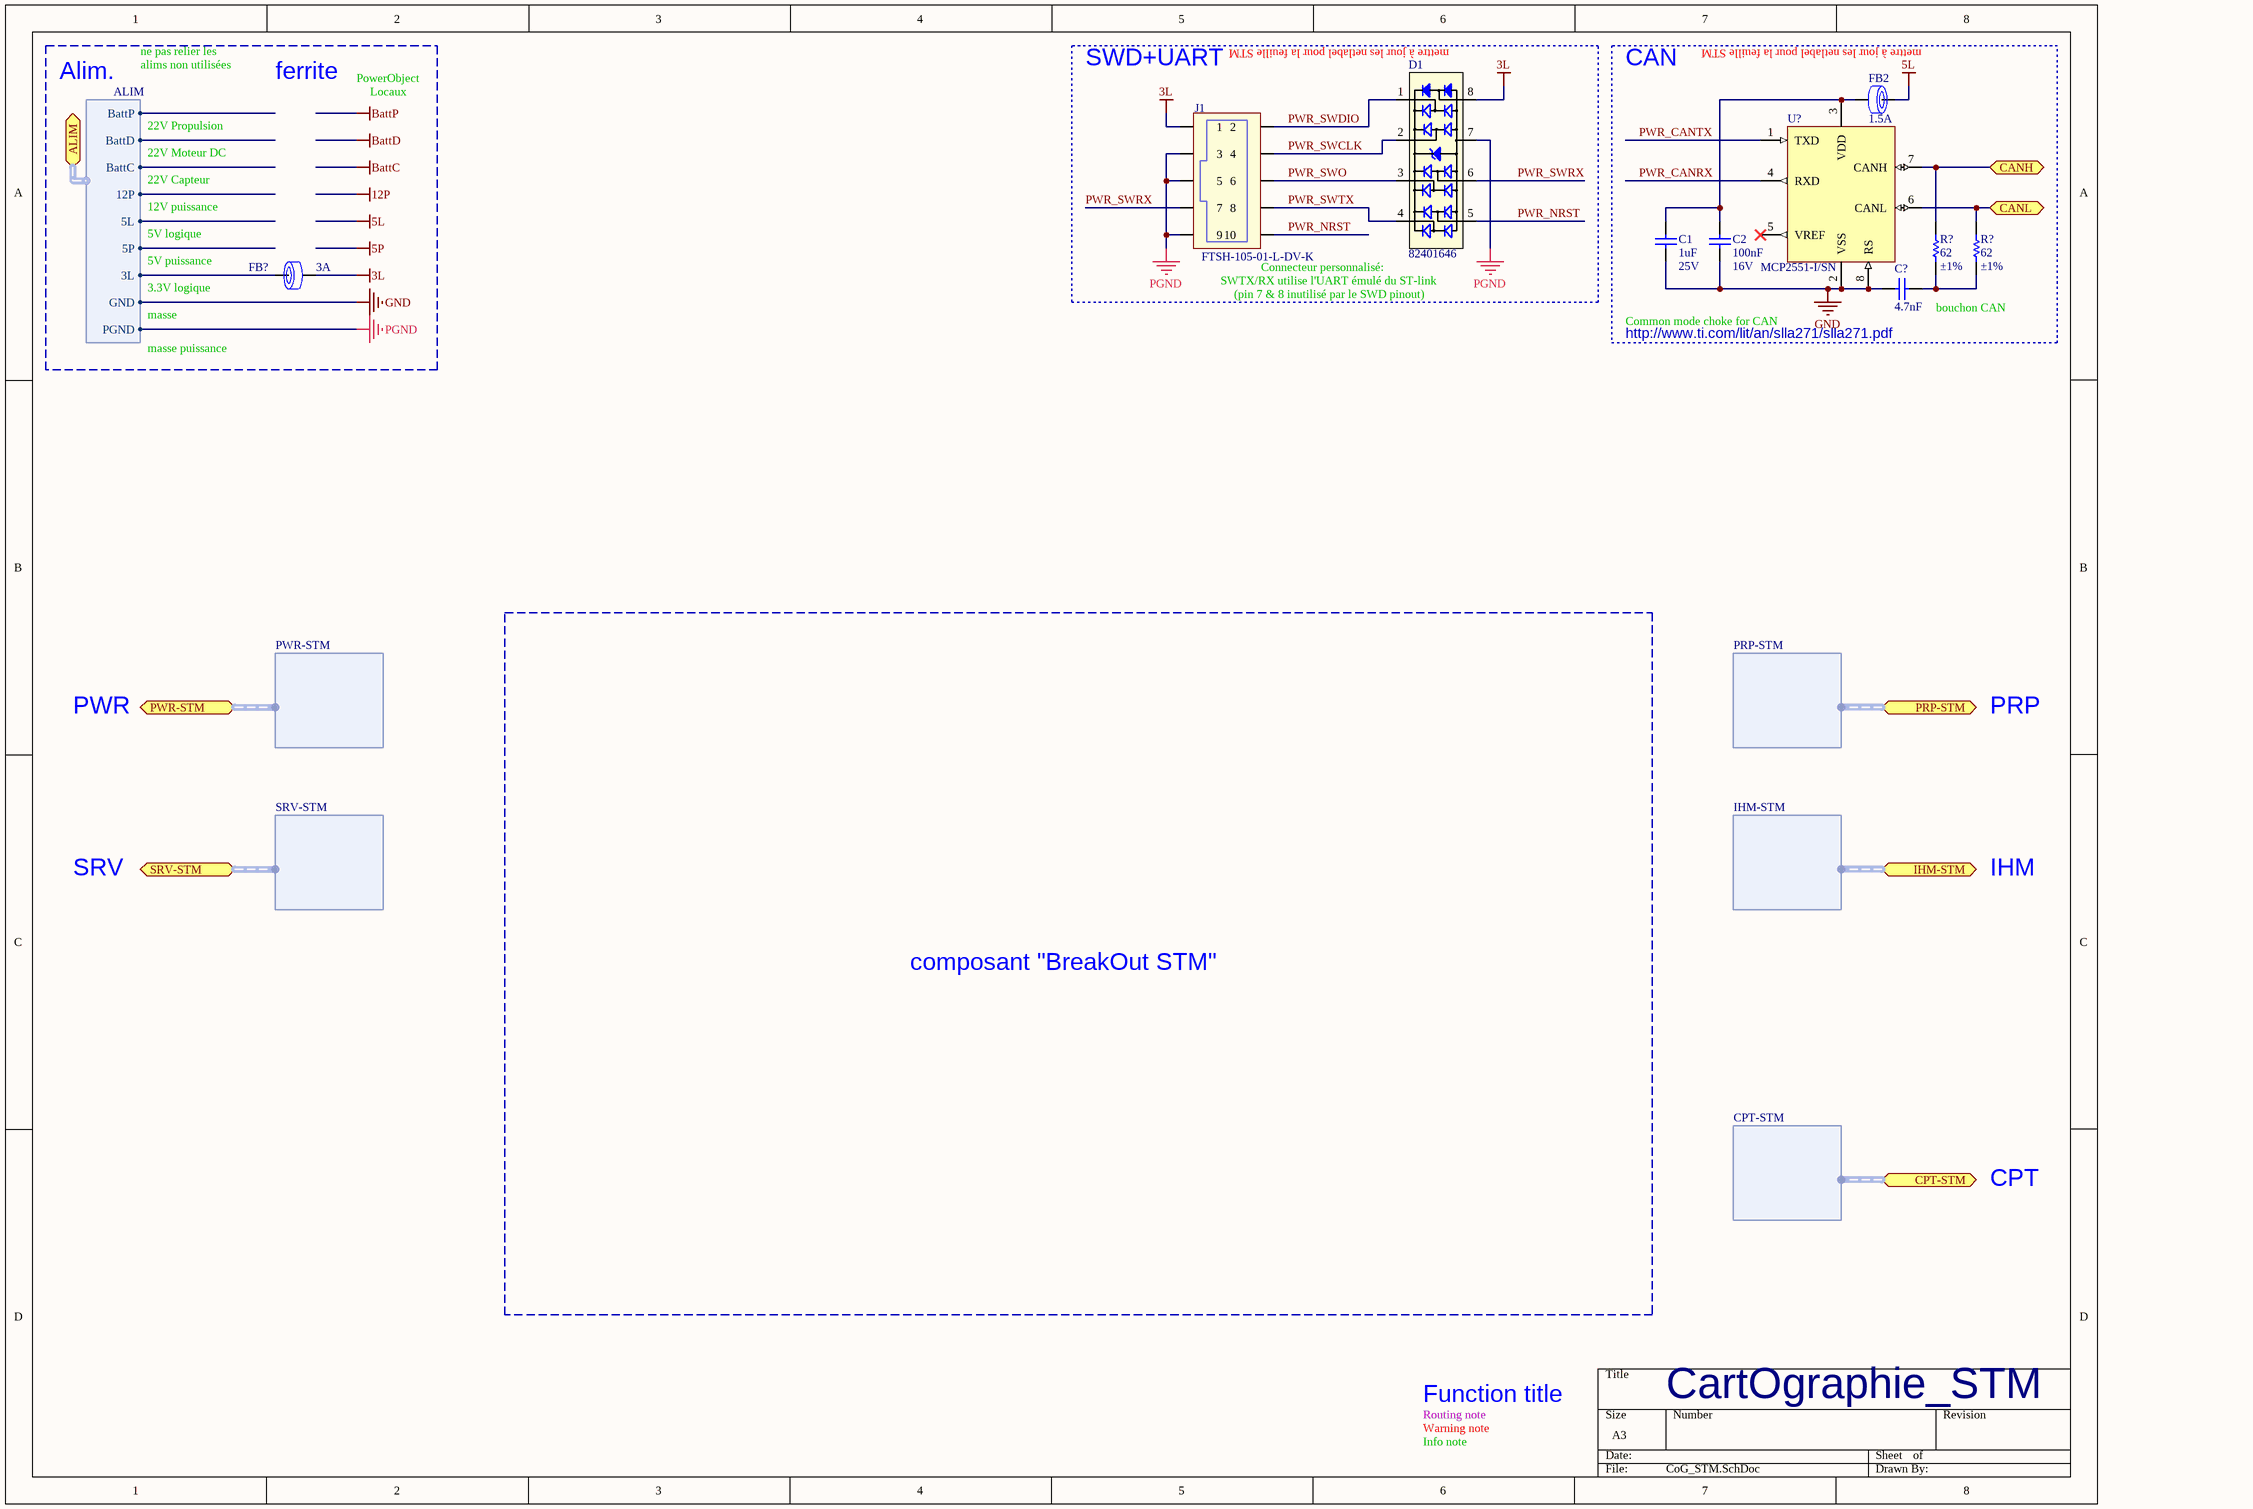
[diagram p5: CoG_STM.SchDoc]

### Parts
(Parts that share a designator on the sheet are numbered #1, #2 ... from top to bottom, then left to right.)
C1  1uF  RatedVoltage: 25V  [WCAP-CSGP_0603, 1.6x0.8x0.8]
C2  100nF  RatedVoltage: 16V  [WCAP-CSGP_0402, 1x0.5x0.5]
C?#10  4.7nF  [WCAP-CSGP_0402, 1x0.5x0.5]
D1  82401646  [MSOP-8L]
FB2  RatedCurrent: 1.5A  [WE-CBF_0603_High Current]  (hidden comment: 742792624)
FB?#6  RatedCurrent: 3A  [WE-CBF_0805_High Current]  (hidden comment: 742792023)
J1  FTSH-105-01-L-DV-K  [FTSH-105-01-L-DV-K]
R?#13  value 62  Precision: ±1%  [RESC1005X04N]  (hidden comment: RC0402FR-0762RL)
R?#14  value 62  Precision: ±1%  [RESC1005X04N]  (hidden comment: RC0402FR-0762RL)
U?  MCP2551-I/SN  [SO8_N]

### Blocks framed on the sheet
SWD+UART: D1 J1
CAN: C1 C2 C?#10 FB2 R?#13 R?#14 U?

### Ports
ALIM (harness ALIM), CANH, CANL, CPT-STM (harness CPT-STM), IHM-STM (harness IHM-STM), PRP-STM (harness PRP-STM), PWR-STM (harness PWR-STM), SRV-STM (harness SRV-STM)

### Harnesses
PRP-STM: 
IHM-STM: 
CPT-STM: 
PWR-STM: 
SRV-STM: 
ALIM: BattP, BattD, BattC, 12P, 5L, 5P, 3L, GND, PGND

### Nets
3L: D1.8 FB?#6.2 J1.1
5L: FB2.1
GND: C1.1 C2.1 C?#10.1 U?.2(VSS) U?.8(RS) ; port ALIM.GND
PGND: D1.7 J1.3 J1.5 J1.9 ; port ALIM.PGND
PWR_CANRX: U?.4(RXD)
PWR_CANTX: U?.1(TXD)
PWR_NRST: D1.5 J1.10
PWR_SWCLK: D1.2 J1.4
PWR_SWDIO: D1.1 J1.2
PWR_SWO: D1.3 J1.6
PWR_SWRX: D1.6 J1.7
PWR_SWTX: D1.4 J1.8
NetC1_2: C1.2 C2.2 FB2.2 U?.3(VDD)
NetC?#10_2: C?#10.2 R?#13.1 R?#14.1
NetFB?#6_1: FB?#6.1 ; port ALIM.3L
NetR?#13_2: R?#13.2 U?.7(CANH) ; port CANH
NetR?#14_2: R?#14.2 U?.6(CANL) ; port CANL

Not connected (* = marked no-connect by the designer): U? 5(VREF)*

### Notes on the sheet
- (near D1) mettre à jour les netlabel pour la feuille STM
- (near FB2) mettre à jour les netlabel pour la feuille STM
- Alim.
- ne pas relier les
- alims non utilisées
- ferrite
- PowerObject
- Locaux
- 22V Propulsion
- 22V Moteur DC
- 22V Capteur
- 5V logique
- 12V puissance
- 5V puissance
- 3.3V logique
- masse
- SWTX/RX utilise l'UART émulé du ST-link
- (pin 7 & 8 inutilisé par le SWD pinout)
- Connecteur personnalisé:
- bouchon CAN
- masse puissance
- (near C?#10) http://www.ti.com/lit/an/slla271/slla271.pdf
- Common mode choke for CAN
- PWR
- PRP
- SRV
- IHM
- composant "BreakOut STM"
- CPT
- Routing note
- Warning note
- Info note
- Function title
- CartOgraphie_STM

### Library data of the parts
C1 = WCAP-CSGP, 885012206076: as C?#7 on sheet CoG_SRV; PublishedDate: Aug 2016; ComponentLink1Description: Manufacturer; ComponentLink1URL: http://www.we-online.de; ComponentLink2Description: Datasheet; ComponentLink2URL: http://katalog.we-online.com/pbs/datasheet/885012206076.pdf; Manufacturer Part Number: 885012206076; Value: 1uF; Size: 0603; CeramicType: X7R
C2 = WCAP-CSGP, 885012205037: as C?#1 on sheet CoG_PWR; PublishedDate: Aug 2016; ComponentLink1Description: Manufacturer; ComponentLink1URL: http://www.we-online.de; ComponentLink2Description: Datasheet; ComponentLink2URL: http://katalog.we-online.com/pbs/datasheet/885012205037.pdf; Value: 100nF; Size: 0402; CeramicType: X7R; Manufacturer Part Number: 885012205037
C?#10 = WCAP-CSGP, 885012205065: CAP CER 4.7nF 50V X7R 0402; Manufacturer: Wurth Elektronik; PublishedDate: Aug 2016; ComponentLink1Description: Manufacturer; ComponentLink1URL: http://www.we-online.de; ComponentLink2Description: Datasheet; ComponentLink2URL: http://katalog.we-online.com/pbs/datasheet/885012205065.pdf; Manufacturer Part Number: 885012205065; Value: 4.7nF; Size: 0402; CeramicType: X7R; RatedVoltage: 50V
D1 = 82401646: TVS DIODE 5VWM 13VC 8MSOP; Manufacturer: Wurth Electronics Inc.; Supplier 1: Farnell; Manufacturer Part Number: 82401646; ComponentLink1URL: http://katalog.we-online.de/pbs/datasheet/82401646.pdf; ComponentLink1Description: Datasheet; Supplier Part Number 1: 1825864
FB2 = WE-CBF, 742792624: as FB?#4 on sheet CoG_SRV; PublishedDate: Aug 2016; ComponentLink1Description: Manufacturer; ComponentLink1URL: http://www.we-online.de; ComponentLink2Description: Datasheet; ComponentLink2URL: http://katalog.we-online.de/pbs/datasheet/742792624.pdf; Manufacturer Part Number: 742792624; Size: 0603
FB?#6 = WE-CBF, 742792023: as FB?#1 on sheet CoG_CPT; PublishedDate: Aug 2016; ComponentLink1Description: Manufacturer; ComponentLink1URL: http://www.we-online.de; ComponentLink2Description: Datasheet; ComponentLink2URL: http://katalog.we-online.de/pbs/datasheet/742792023.pdf; Manufacturer Part Number: 742792023; Size: 0805
J1 = FTSH-105-01-L-DV-K: CONN HEADER 10 POS DUAL .05" SMD with Keying; Manufacturer: Samtec Inc.; Supplier 1: Digi-Key; Manufacturer Part Number: FTSH-105-01-L-DV-K; ComponentLink1URL: http://suddendocs.samtec.com/prints/ftsh-1xx-xx-xxx-dv-xxx-xxx-mkt.pdf; ComponentLink1Description: Datasheet; Supplier Part Number 1: SAM8799-ND
R?#13 R?#14 = RC0402FR-0762RL: RES SMD 62 OHM 1% 1/16W 0402; Manufacturer: Yageo; Power: 63mW; Vmax: 50V; Type: Thick Film; ComponentLink1Description: Manufacturer; ComponentLink1URL: http://www.yageo.com/NewPortal/_en/index.jsp; ComponentLink2Description: Datasheet; ComponentLink2URL: http://www.farnell.com/datasheets/2167052.pdf; Manufacturer Part Number: RC0402FR-0762RL; Supplier 1: Farnell; Supplier Part Number 1: 1458813
U? = MCP2551-I/SN: IC TRANSCEIVER CAN HI-SPD 8-SOIC; Manufacturer: Microchip Technology; Manufacturer Part Number: MCP2551-I/SN; ComponentLink1Description: Datasheet; ComponentLink1URL: http://www.farnell.com/datasheets/657417.pdf; Supplier 1: Farnell; Supplier Part Number 1: 9758569

## Sheet CoG_DE0.SchDoc
size A3; Author: Audran; CompanyName: Goldorak; Address1: Electrolab; Address2: 52 rue Paul Lescop; Address3: 92000 Nanterre; ProjectName: Cartes_2017
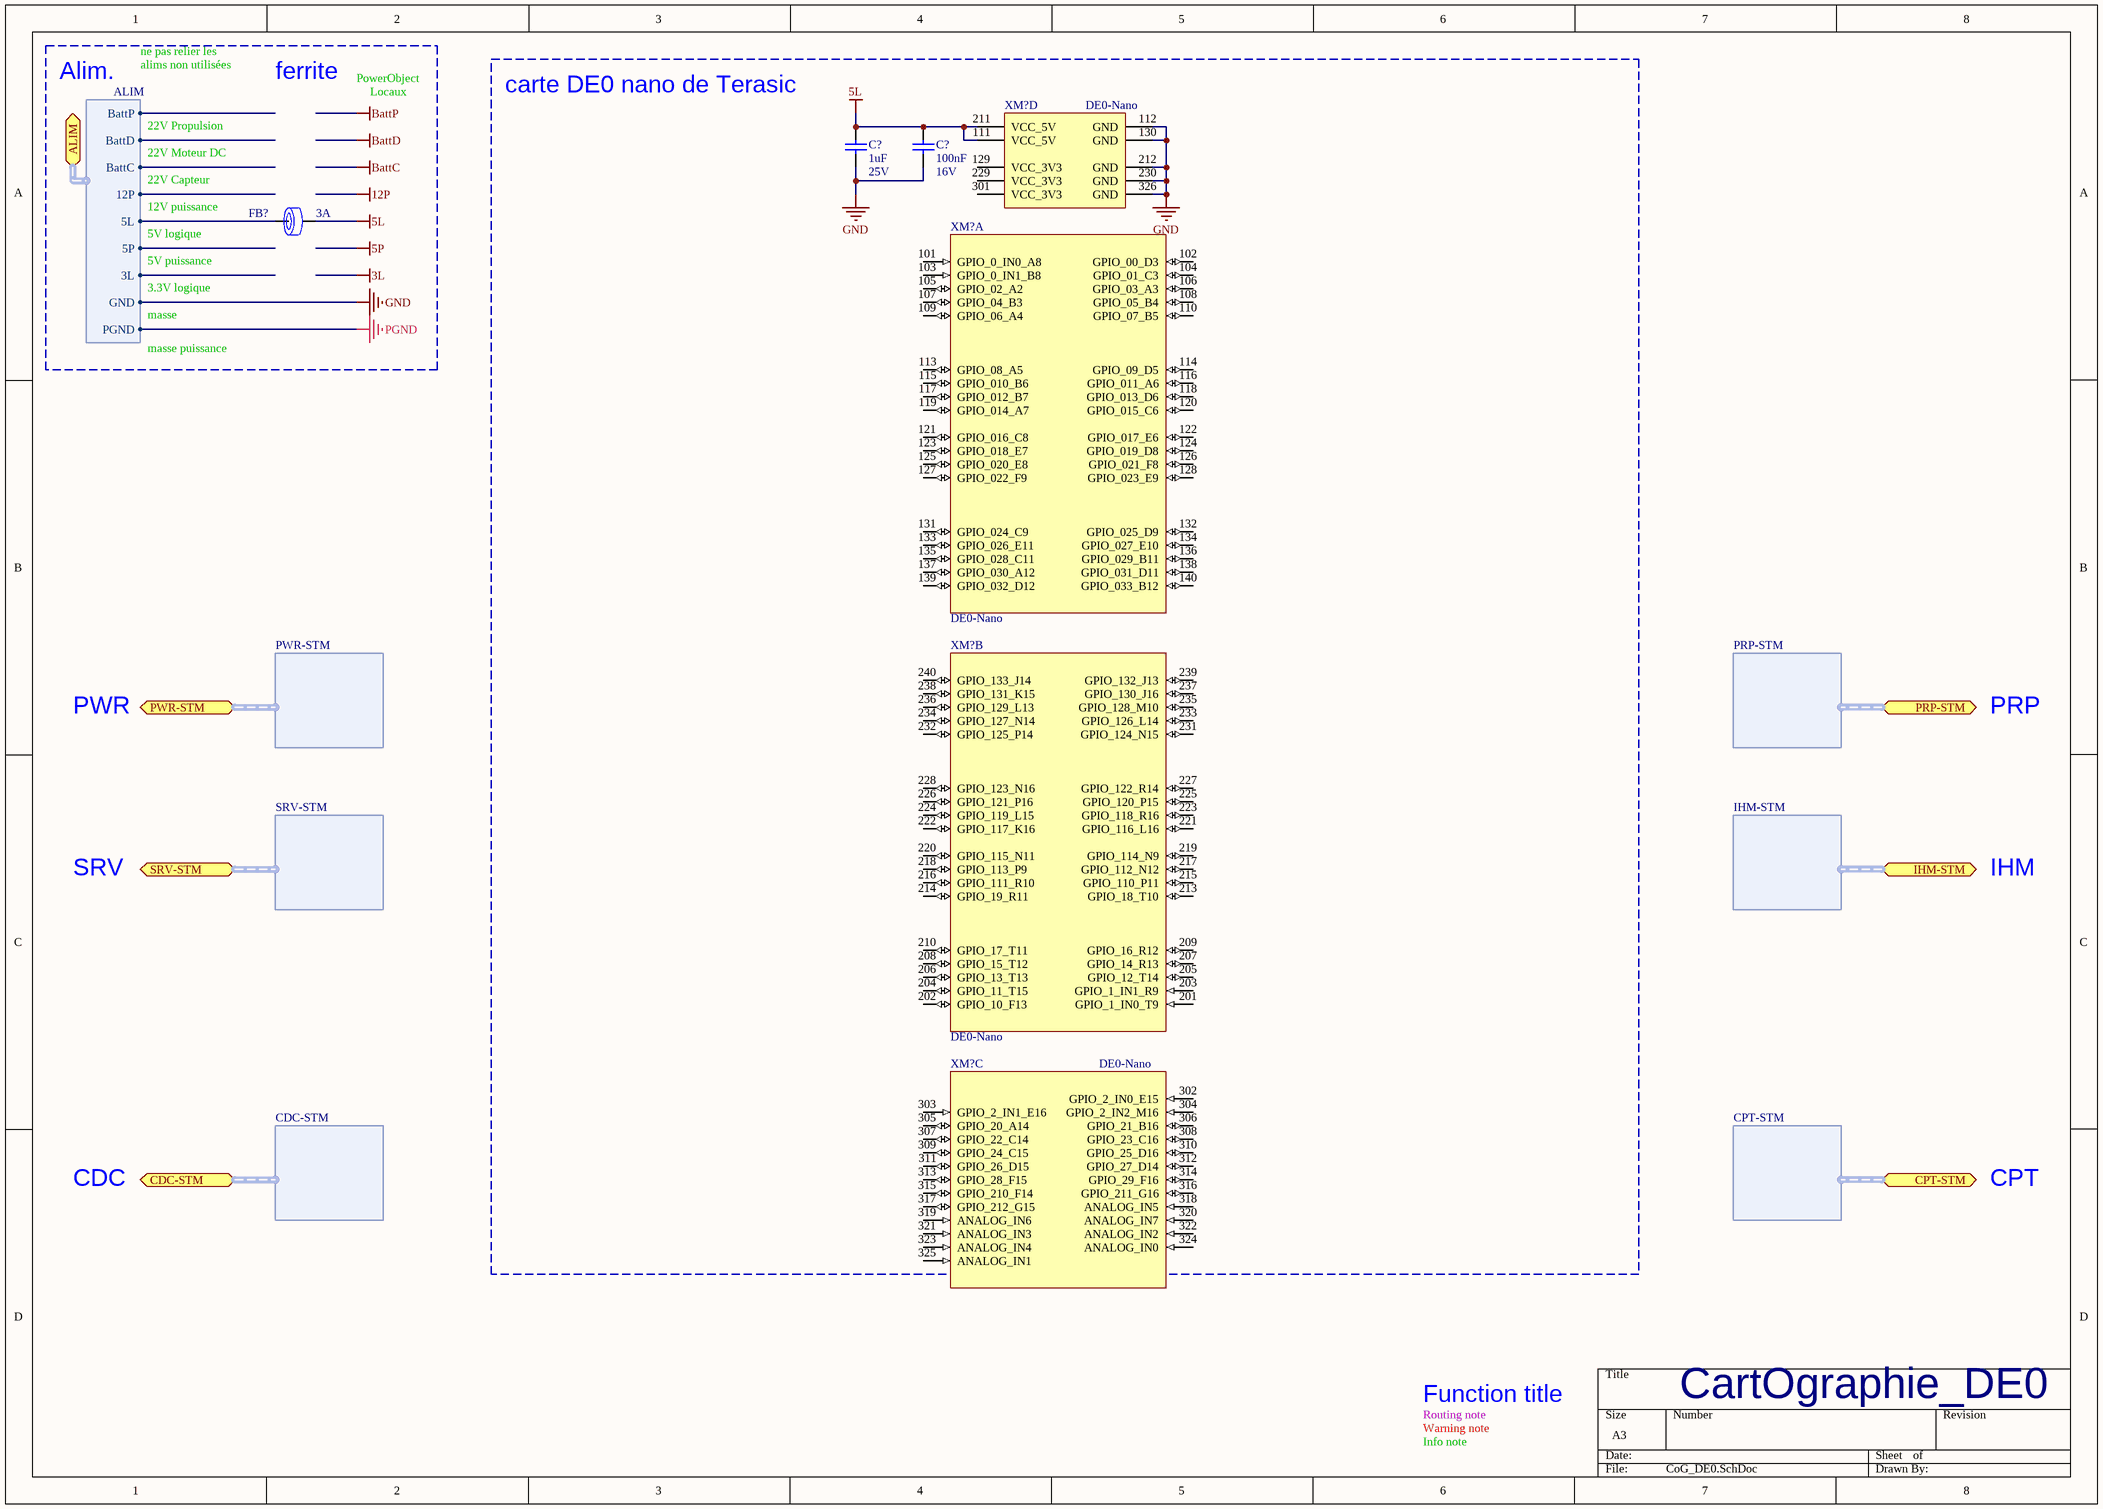
[diagram p6: CoG_DE0.SchDoc]

### Parts
(Parts that share a designator on the sheet are numbered #1, #2 ... from top to bottom, then left to right.)
C?#11  1uF  RatedVoltage: 25V  [WCAP-CSGP_0603, 1.6x0.8x0.8]
C?#12  100nF  RatedVoltage: 16V  [WCAP-CSGP_0402, 1x0.5x0.5]
FB?#7  RatedCurrent: 3A  [WE-CBF_0805_High Current]  (hidden comment: 742792023)
XM?#1  DE0-Nano  [DE0-NANO_SMT]  (part D of 4)
XM?#2  DE0-Nano  [DE0-NANO_SMT]  (part A of 4)
XM?#3  DE0-Nano  [DE0-NANO_SMT]  (part B of 4)
XM?#4  DE0-Nano  [DE0-NANO_SMT]  (part C of 4)

### Blocks framed on the sheet
carte DE0 nano de Terasic: C?#11 C?#12 XM?#1-XM?#4

### Ports
ALIM (harness ALIM), CDC-STM (harness CDC-STM), CPT-STM (harness CPT-STM), IHM-STM (harness IHM-STM), PRP-STM (harness PRP-STM), PWR-STM (harness PWR-STM), SRV-STM (harness SRV-STM)

### Harnesses
PRP-STM: 
IHM-STM: 
CPT-STM: 
PWR-STM: 
SRV-STM: 
CDC-STM: 
ALIM: BattP, BattD, BattC, 12P, 5L, 5P, 3L, GND, PGND

### Nets
5L: C?#11.1 C?#12.2 FB?#7.2 XM?#1.111(VCC_5V) XM?#1.211(VCC_5V)
GND: C?#11.2 C?#12.1 XM?#1.112(GND) XM?#1.130(GND) XM?#1.212(GND) XM?#1.230(GND) XM?#1.326(GND) ; port ALIM.GND
NetFB?#7_1: FB?#7.1 ; port ALIM.5L

Not connected (* = marked no-connect by the designer): XM?#1 129(VCC_3V3) 229(VCC_3V3) 301(VCC_3V3); XM?#2 101(GPIO_0_IN0_A8) 102(GPIO_00_D3) 103(GPIO_0_IN1_B8) 104(GPIO_01_C3) 105(GPIO_02_A2) 106(GPIO_03_A3) 107(GPIO_04_B3) 108(GPIO_05_B4) 109(GPIO_06_A4) 110(GPIO_07_B5) 113(GPIO_08_A5) 114(GPIO_09_D5) 115(GPIO_010_B6) 116(GPIO_011_A6) 117(GPIO_012_B7) 118(GPIO_013_D6) 119(GPIO_014_A7) 120(GPIO_015_C6) 121(GPIO_016_C8) 122(GPIO_017_E6) 123(GPIO_018_E7) 124(GPIO_019_D8) 125(GPIO_020_E8) 126(GPIO_021_F8) 127(GPIO_022_F9) 128(GPIO_023_E9) 131(GPIO_024_C9) 132(GPIO_025_D9) 133(GPIO_026_E11) 134(GPIO_027_E10) 135(GPIO_028_C11) 136(GPIO_029_B11) 137(GPIO_030_A12) 138(GPIO_031_D11) 139(GPIO_032_D12) 140(GPIO_033_B12); XM?#3 201(GPIO_1_IN0_T9) 202(GPIO_10_F13) 203(GPIO_1_IN1_R9) 204(GPIO_11_T15) 205(GPIO_12_T14) 206(GPIO_13_T13) 207(GPIO_14_R13) 208(GPIO_15_T12) 209(GPIO_16_R12) 210(GPIO_17_T11) 213(GPIO_18_T10) 214(GPIO_19_R11) 215(GPIO_110_P11) 216(GPIO_111_R10) 217(GPIO_112_N12) 218(GPIO_113_P9) 219(GPIO_114_N9) 220(GPIO_115_N11) 221(GPIO_116_L16) 222(GPIO_117_K16) 223(GPIO_118_R16) 224(GPIO_119_L15) 225(GPIO_120_P15) 226(GPIO_121_P16) 227(GPIO_122_R14) 228(GPIO_123_N16) 231(GPIO_124_N15) 232(GPIO_125_P14) 233(GPIO_126_L14) 234(GPIO_127_N14) 235(GPIO_128_M10) 236(GPIO_129_L13) 237(GPIO_130_J16) 238(GPIO_131_K15) 239(GPIO_132_J13) 240(GPIO_133_J14); XM?#4 302(GPIO_2_IN0_E15) 303(GPIO_2_IN1_E16) 304(GPIO_2_IN2_M16) 305(GPIO_20_A14) 306(GPIO_21_B16) 307(GPIO_22_C14) 308(GPIO_23_C16) 309(GPIO_24_C15) 310(GPIO_25_D16) 311(GPIO_26_D15) 312(GPIO_27_D14) 313(GPIO_28_F15) 314(GPIO_29_F16) 315(GPIO_210_F14) 316(GPIO_211_G16) 317(GPIO_212_G15) 318(ANALOG_IN5) 319(ANALOG_IN6) 320(ANALOG_IN7) 321(ANALOG_IN3) 322(ANALOG_IN2) 323(ANALOG_IN4) 324(ANALOG_IN0) 325(ANALOG_IN1)

### Notes on the sheet
- Alim.
- ne pas relier les
- alims non utilisées
- ferrite
- PowerObject
- Locaux
- 22V Propulsion
- 22V Moteur DC
- 22V Capteur
- 5V logique
- 12V puissance
- 5V puissance
- 3.3V logique
- masse
- masse puissance
- PWR
- PRP
- SRV
- IHM
- CDC
- CPT
- Routing note
- Warning note
- Info note
- Function title
- CartOgraphie_DE0

### Library data of the parts
C?#11 = WCAP-CSGP, 885012206076: as C?#7 on sheet CoG_SRV; PublishedDate: Aug 2016; ComponentLink1Description: Manufacturer; ComponentLink1URL: http://www.we-online.de; ComponentLink2Description: Datasheet; ComponentLink2URL: http://katalog.we-online.com/pbs/datasheet/885012206076.pdf; Manufacturer Part Number: 885012206076; Value: 1uF; Size: 0603; CeramicType: X7R
C?#12 = WCAP-CSGP, 885012205037: as C?#1 on sheet CoG_PWR; PublishedDate: Aug 2016; ComponentLink1Description: Manufacturer; ComponentLink1URL: http://www.we-online.de; ComponentLink2Description: Datasheet; ComponentLink2URL: http://katalog.we-online.com/pbs/datasheet/885012205037.pdf; Value: 100nF; Size: 0402; CeramicType: X7R; Manufacturer Part Number: 885012205037
FB?#7 = WE-CBF, 742792023: as FB?#1 on sheet CoG_CPT; PublishedDate: Aug 2016; ComponentLink1Description: Manufacturer; ComponentLink1URL: http://www.we-online.de; ComponentLink2Description: Datasheet; ComponentLink2URL: http://katalog.we-online.de/pbs/datasheet/742792023.pdf; Manufacturer Part Number: 742792023; Size: 0805
XM?#1-XM?#4 = DE0-NANO_CMS_FULL: carte DE0-Nano modifié pour embase CMS (garde 10mm); Manufacturer: TERASIC; Supplier Part Number 1: 2x 61004021821, 1x 61002621821; Supplier 1: Wurth Elektronik; Manufacturer Part Number: DE0-Nano; ComponentLink1URL: http://www.terasic.com.tw/cgi-bin/page/archive.pl?Language=English&CategoryNo=165&No=593&PartNo=1; ComponentLink1Description: Product page

## Nets that join several sheets
3L: CoG_CPT (FB?#3.2), CoG_PWR (7 pins), CoG_SRV (FB?#5.2), CoG_STM (D1.8 FB?#6.2 J1.1)
5L: CoG_CPT (FB?#2.2), CoG_PWR (J12.4), CoG_STM (FB2.1), CoG_DE0 (5 pins)
5P: CoG_PWR (J12.3), CoG_SRV (C?#5.1 L?#1.1 L?#2.1)
BattC: CoG_CPT (FB?#1.2), CoG_PWR (CI?#3.4 R?#7.2)
GND: CoG_PWR (5 pins), CoG_SRV (J?#8.1), CoG_STM (5 pins), CoG_DE0 (7 pins)
PGND: CoG_PWR (11 pins), CoG_SRV (14 pins), CoG_STM (D1.7 J1.3 J1.5 J1.9)